# Altium schematic sheet AnalogOutputs.SchDoc
size A3
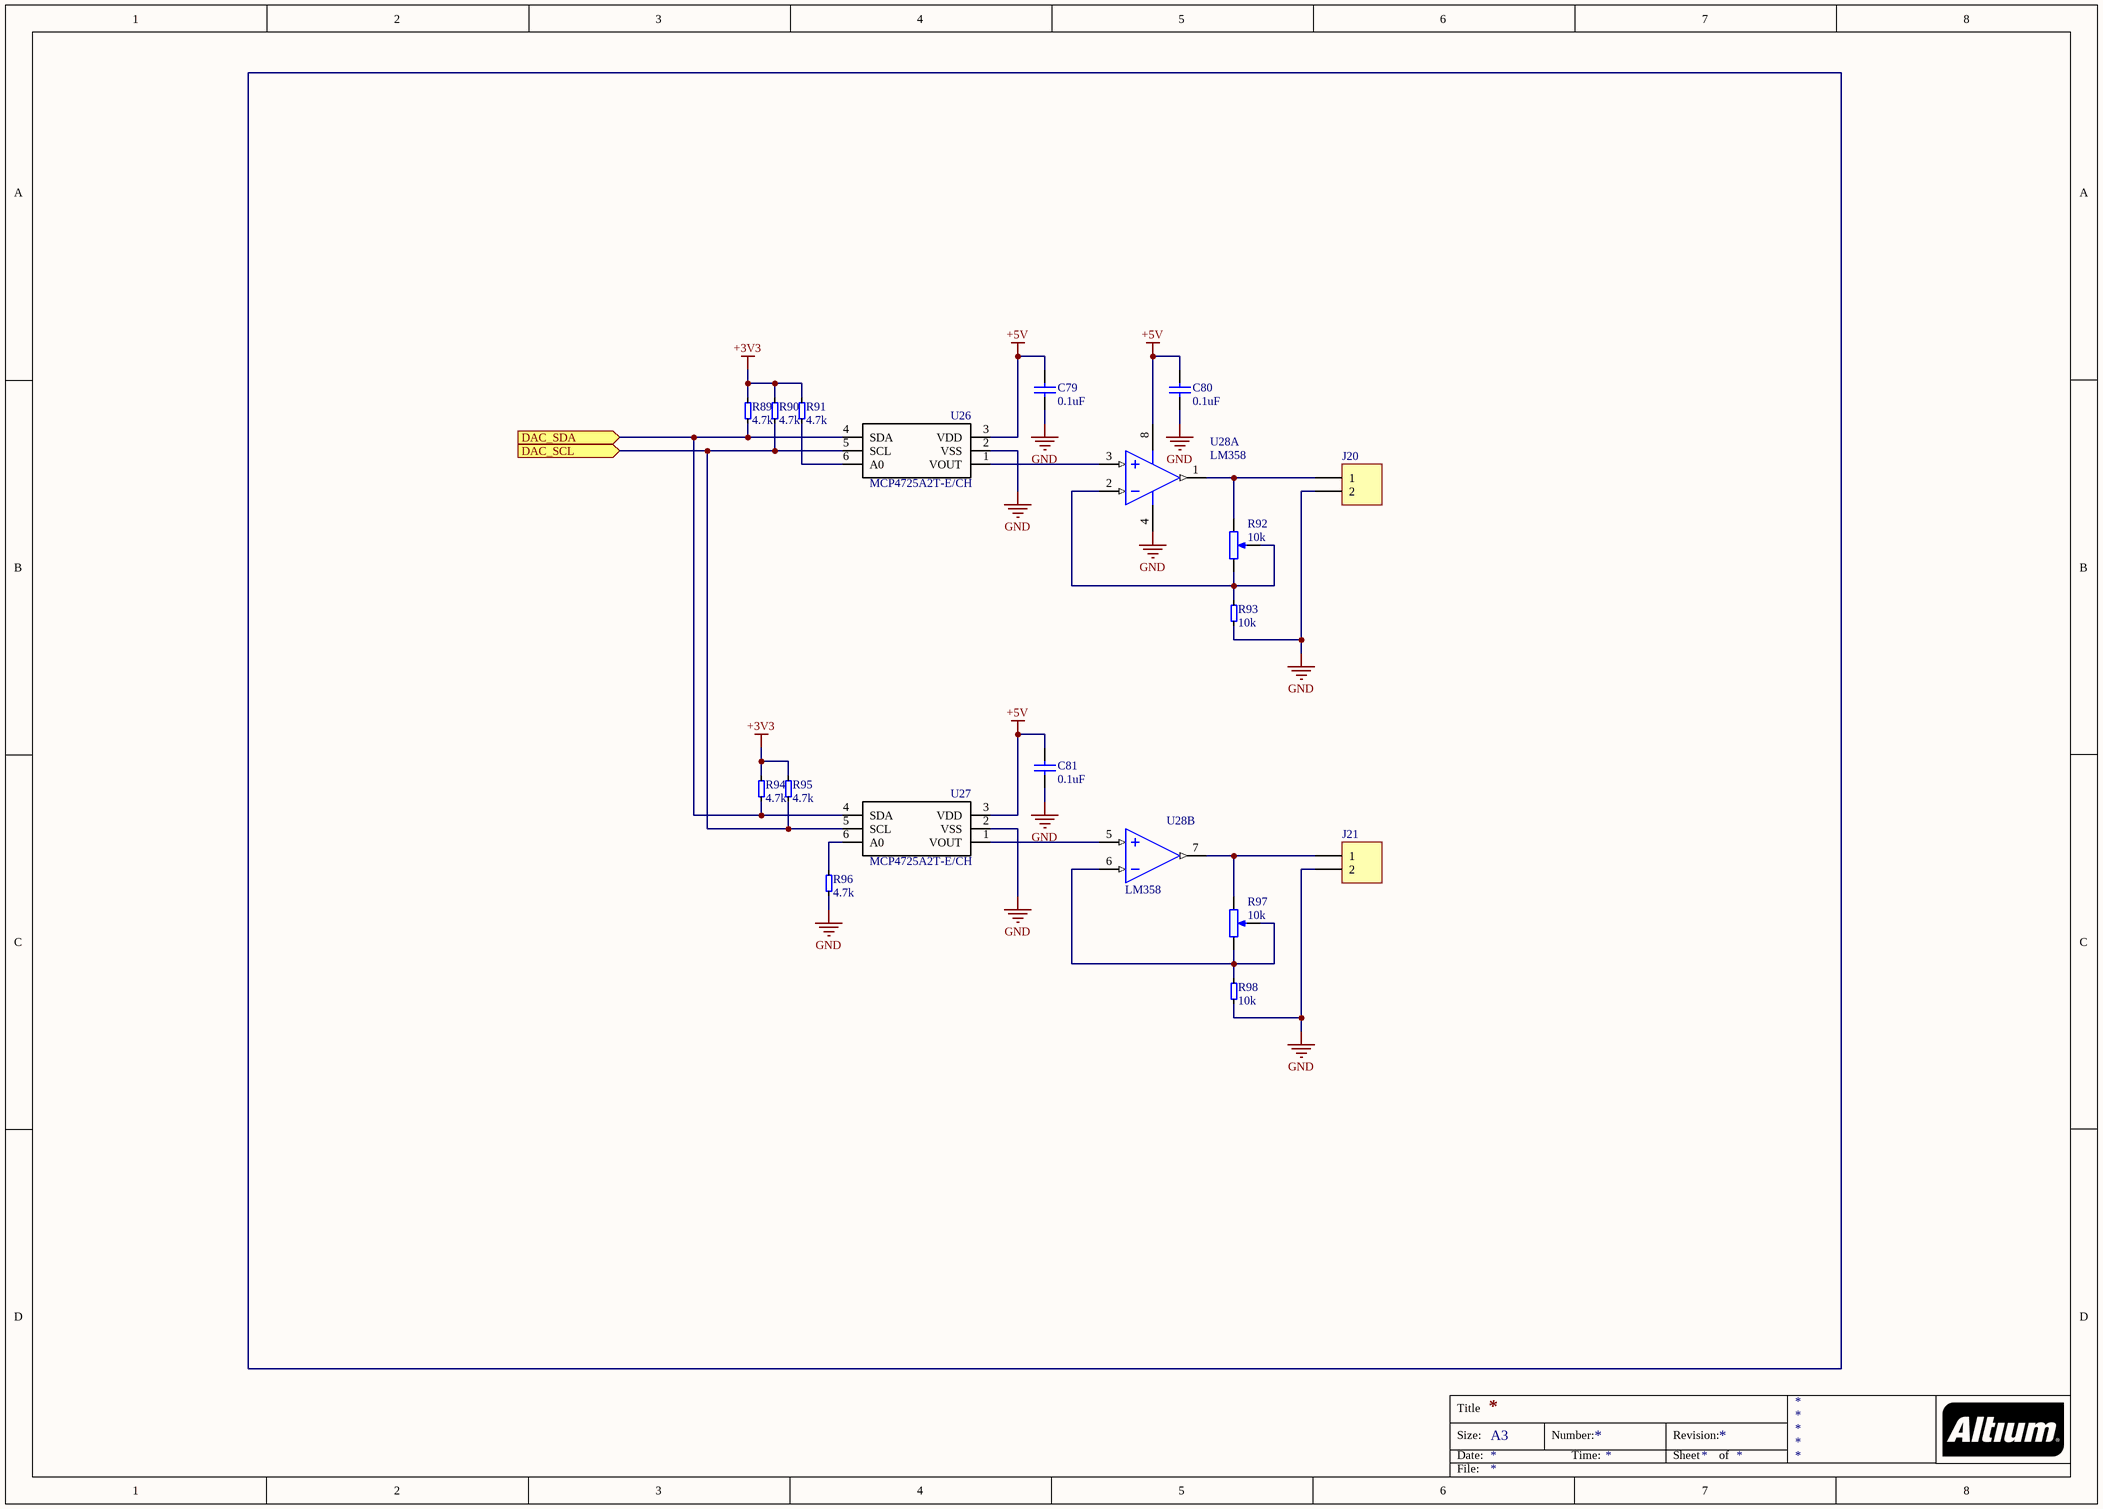
[diagram p0: AnalogOutputs.SchDoc]

## Parts
C79  0.1uF  [C_ceramic_0603]
C80  0.1uF  [C_ceramic_0603]
C81  0.1uF  [C_ceramic_0603]
J20  CIM025P5  [HDR1X2]  (value not drawn)
J21  CIM025P5  [HDR1X2]  (value not drawn)
R89  4.7k  [R_0603]
R90  4.7k  [R_0603]
R91  4.7k  [R_0603]
R92  10k  [ST4EA_Trimmer]
R93  10k  [R_0603]
R94  4.7k  [R_0603]
R95  4.7k  [R_0603]
R96  4.7k  [R_0603]
R97  10k  [ST4EA_Trimmer]
R98  10k  [R_0603]
U26  MCP4725A2T-E/CH  [SOT-23-6_MC]
U27  MCP4725A2T-E/CH  [SOT-23-6_MC]
U28  LM358  [SOIC-8 - 3.9mm Body]  (parts A,B of 2)

## Ports
DAC_SCL (in), DAC_SDA (in)

## Nets
+3V3: R89.1 R90.1 R91.1 R94.1 R95.1
+5V: C79.2 C80.2 C81.2 U26.3(VDD) U27.3(VDD) U28.8(V+)
GND: C79.1 C80.1 C81.1 J20.2 J21.2 R93.2 R96.2 R98.2 U26.2(VSS) U27.2(VSS) U28.4(GND)
DAC_SCL: R90.2 R95.2 U26.5(SCL) U27.5(SCL) ; port DAC_SCL
DAC_SDA: R89.2 R94.2 U26.4(SDA) U27.4(SDA) ; port DAC_SDA
NetJ20_1: J20.1 R92.1(TOP) U28.1(OUT_A)
NetJ21_1: J21.1 R97.1(TOP) U28.7(OUT_B)
NetR91_2: R91.2 U26.6(A0)
NetR92_2: R92.2(BOT) R92.3(TAP) R93.1 U28.2(IN_A-)
NetR96_1: R96.1 U27.6(A0)
NetR97_2: R97.2(BOT) R97.3(TAP) R98.1 U28.6(IN_B-)
NetU26_1: U26.1(VOUT) U28.3(IN_A+)
NetU27_1: U27.1(VOUT) U28.5(IN_B+)

## Notes on the sheet
- Title
- Size:
- Date:
- A3
- Number:
- Time:
- Revision:
- Sheet
- of
- File:

## Library data of the parts
C79-C81 = Cap: CAP CER 0.1UF 50V X7R 0603; Manufacturer: Yageo; Manufacturer Part Number: CC0603KPX7R9BB104; Supplier 1: Digi-Key; Supplier Part Number 1: 311-3567-1-ND
J20 J21 = Header 2: TERM BLK 2P SIDE ENT 5.08MM PCB; Manufacturer: Sauro; Manufacturer Part Number: CIM025P5; Supplier 1: Digi-Key
R89-R91 R93-R96 R98 = R_0402: RES SMD 80.6K OHM 1% 1/10W 0603; Manufacturer: Yageo; Manufacturer Part Number: RC0603FR-0780K6L; Resistance: 80.6kR; Temperature Coefficient: 100ppm/°C; Power Rating: 100mW; Voltage Rating: 50V; ComponentLink1URL: http://www.farnell.com/datasheets/2167052.pdf?src-supplier=Element14; ComponentLink1Description: http://www.farnell.com/datasheets/2167052.pdf?src-supplier=Element14; ComponentLink2URL: http://www.farnell.com/datasheets/1784430.pdf?src-supplier=Element14; ComponentLink2Description: http://www.farnell.com/datasheets/1784430.pdf?src-supplier=Element14; ComponentLink3URL: http://documents.rs-components.com/techlib://itc_doclist_GB.htm?stockno=6185832&src-supplier=RSComponents; ComponentLink3Description: http://documents.rs-components.com/techlib://itc_doclist_GB.htm?stockno=6185832&src-supplier=RSComponents; ComponentLink4URL: http://www.yageo.com/documents/recent/PYu-RC0402_51_RoHS_L_6_r.pdf?src-supplier=Future+Electronics; ComponentLink4Description: http://www.yageo.com/documents/recent/PYu-RC0402_51_RoHS_L_6_r.pdf?src-supplier=Future+Electronics; ComponentLink5URL: http://www.farnell.com/datasheets/1686128.pdf?src-supplier=Element14; ComponentLink5Description: http://www.farnell.com/datasheets/1686128.pdf?src-supplier=Element14; ComponentLink6URL: http://www.farnell.com/datasheets/1018594.pdf?src-supplier=Element14; ComponentLink6Description: http://www.farnell.com/datasheets/1018594.pdf?src-supplier=Element14; ComponentLink7URL: http://www.yageo.com/documents/recent/PYu-RC_Group_51_RoHS_L_9.pdf?src-supplier=Mouser; ComponentLink7Description: http://www.yageo.com/documents/recent/PYu-RC_Group_51_RoHS_L_9.pdf?src-supplier=Mouser; Supplier 1: Digi-Key; Supplier 2: Digi-Key; Supplier Part Number 2: 311-80.6KHRCT-ND; Stock 2: 487759; Pricing 2: 1=0.1, 10=0.023, 100=0.0094, 1000=0.00421, 2500=0.00366 (USD); Mount: Surface Mount; Case/Package: 0603; Contact Plating: Tin,Matte; Case Code (Metric): 1608; Case Code (Imperial): 0603; Min Operating Temperature: -55°C; Max Operating Temperature: 155°C; Tolerance: 1%; Composition: Thick Film; Packaging: Tape and Reel; Package Quantity: 1; Number of Terminations: 2; Termination: SMD/SMT; Military Standard: Not; Max Power Dissipation: 100mW; Voltage Rating (DC): 50V; Features: Moisture Resistant; Length: 1.6mm; Height: 0.45mm; Width: 0.031inch; Depth: 0.8mm; Radiation Hardening: No; Lead Free: Lead Free; ComponentLink8URL: http://www.yageo.com/documents/recent/PYu-RC_Group_51_RoHS_L_9.pdf?src-supplier=Digi-Key; ComponentLink8Description: http://www.yageo.com/documents/recent/PYu-RC_Group_51_RoHS_L_9.pdf?src-supplier=Digi-Key; ComponentLink9URL: http://www.yageo.com/documents/recent/PYu-RC_Group_51_RoHS_L_10.pdf?src-supplier=Digi-Key; ComponentLink9Description: http://www.yageo.com/documents/recent/PYu-RC_Group_51_RoHS_L_10.pdf?src-supplier=Digi-Key; ComponentLink10URL: http://www.mouser.com/catalog/specsheets/RC0603.pdf?src-supplier=Mouser; ComponentLink10Description: http://www.mouser.com/catalog/specsheets/RC0603.pdf?src-supplier=Mouser; ComponentLink11URL: http://documents.rs-components.com/techlib://itc_doclist_GB.htm?stockno=5048473&src-supplier=RSComponents; ComponentLink11Description: http://documents.rs-components.com/techlib://itc_doclist_GB.htm?stockno=5048473&src-supplier=RSComponents
R92 R97 = RPot: Potentiometer; Sim Note: Enter the Resistance value and the set point into parameter fields.; Set Position: 0.5; Value: 1K; Published: 8-Jun-2000; LatestRevisionDate: 17-Jul-2002; LatestRevisionNote: Re-released for DXP Platform.; PackageReference: VR5; Publisher: Altium Limited; PackageDescription: Variable Resistor, Thru-Hole; 3 Leads
U26 U27 = MCP4725A2T-E/CH: 12 Bit Digital to Analog Converter 1 SOT-23-6; MF: Microchip; Availability: Unavailable; SnapEDA_Link: https://www.snapeda.com/parts/MCP4725A2T-E/CH/Microchip/view-part/108042/?ref=snap; MP: MCP4725A2T-E/CH; Price: None; Package: SOT-23-6 Microchip; Value: *
U28 = Op Amp: Linear Operational Amplifier; Published: 8-Jun-2000; LatestRevisionDate: 17-Jul-2002; LatestRevisionNote: Re-released for DXP Platform.; DatasheetVersion: REV. B; PackageVersion: 1990; PackageReference: H-08A; Publisher: Altium Limited; PackageDescription: Can; 8 Leads; Pin Circle Dia. 5.08 mm; Lead Dia. 0.53 mm (max); ComponentLink1Description: Manufacturer Link; ComponentLink1URL: http://www.analog.com/